# Altium schematic sheet DS18B20.SchDoc
size A4
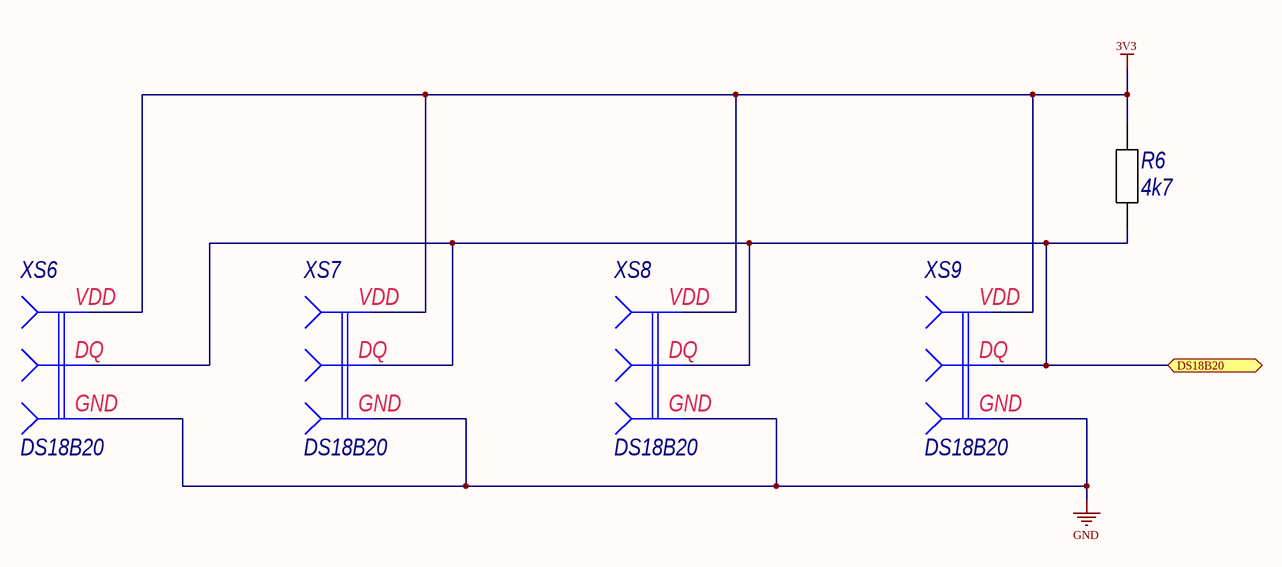
[diagram p0: DS18B20.SchDoc]

## Parts
R6  4k7  [C0805R]
XS6  DS18B20  [YX-XH-3]
XS7  DS18B20  [YX-XH-3]
XS8  DS18B20  [YX-XH-3]
XS9  DS18B20  [YX-XH-3]

## Ports
DS18B20 (bidir)

## Nets
3V3: R6.1 XS6.1 XS7.1 XS8.1 XS9.1
GND: XS6.3 XS7.3 XS8.3 XS9.3
DS18B20: R6.2 XS6.2 XS7.2 XS8.2 XS9.2 ; port DS18B20

## Notes on the sheet
- (in symbol DS18B20) VDD; DQ; GND

## Library data of the parts
R6 = R0805: Published: 24.03.2010; Publisher: Andrew Danich; Type: Резистор
XS6-XS9 = DS18B20: Published: 07.03.2013; Publisher: Andrew Danich; Type: Розетка